# EAGLE design Moteino (EAGLE 6.3)
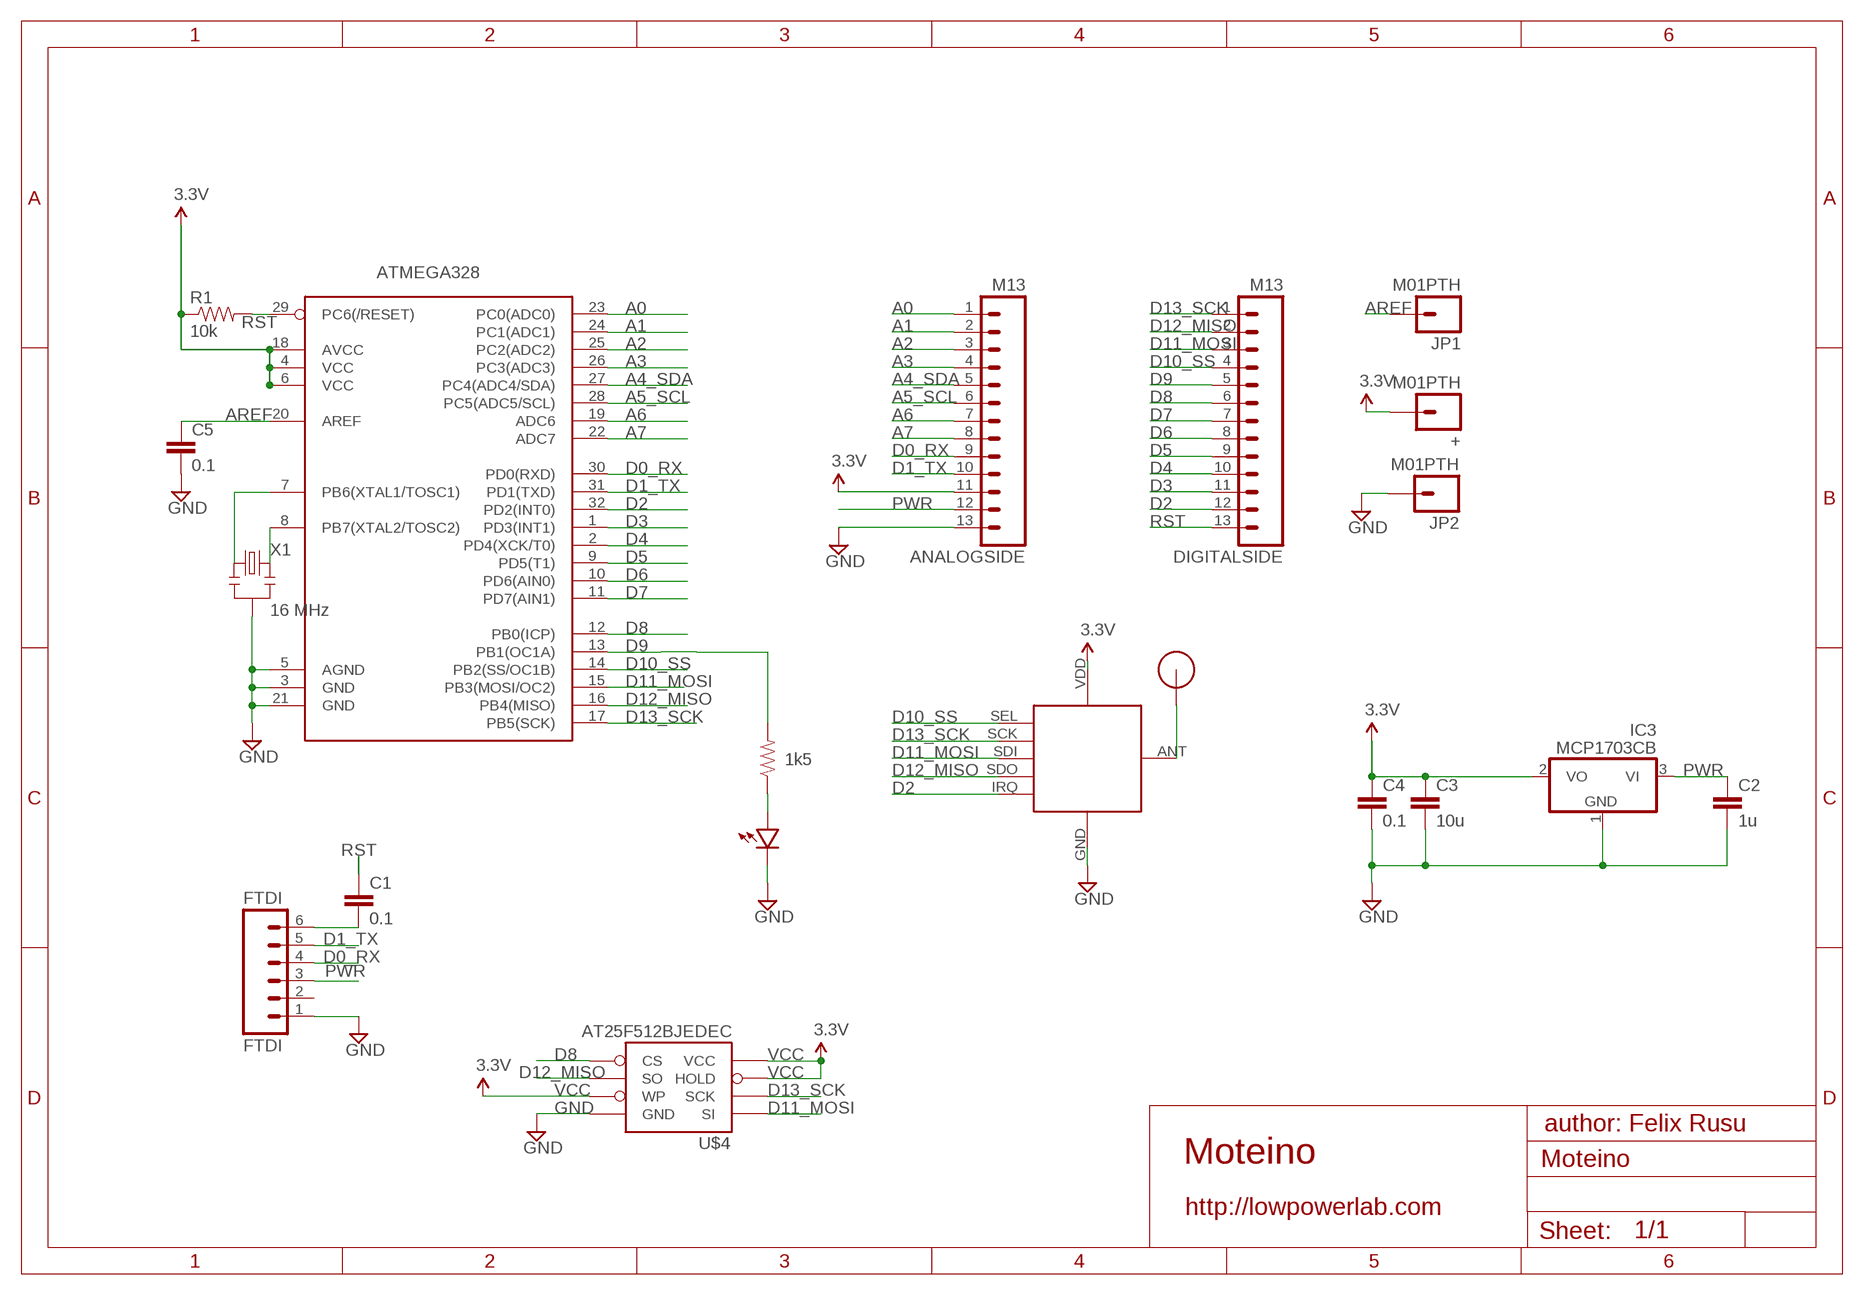
[diagram p0: schematic, sheet 1]

## Parts
+  M01PTH  [1X01]
ANALOGSIDE  M13  [1X13]
ATMEGA328  ATMega-328  ATMEGA168/328TQFP32  [TQFP32-08]
C1  0.1  CAP0603-CAP  [0603-CAP]
C2  1u  CAP0603-CAP  [0603-CAP]
C3  10u  CAP0805-CAP  [0805-CAP]
C4  0.1  CAP0603-CAP  [0603-CAP]
C5  0.1  CAP0603-CAP  [0603-CAP]
DIGITALSIDE  M13  [1X13]
FTDI  FTDI  M06SIP  [1X06]
IC3  MCP1703CB  [SOT23]
JP1  M01PTH  [1X01]
JP2  M01PTH  [1X01]
R1  10k  RESISTOR0603-RES  [0603-RES]
R2  1k5  RESISTOR0603-RES  [0603-RES]
RFM12B  RFM12B_MINPADS  [RFM12B-MINPADS]
U$1  RFM12B_ANTENNA  [RFM12B-ANTENNA]
U$2  LED0603  [0603-LED]
U$4  AT25F512BJEDEC  [SO08]
X1  16 MHz  RESONATORSMD  [RESONATOR-SMD]

## Nets
A0: ANALOGSIDE.1 ATMEGA328.23(PC0(ADC0))
A1: ANALOGSIDE.2 ATMEGA328.24(PC1(ADC1))
A2: ANALOGSIDE.3 ATMEGA328.25(PC2(ADC2))
A3: ANALOGSIDE.4 ATMEGA328.26(PC3(ADC3))
A4_SDA: ANALOGSIDE.5 ATMEGA328.27(PC4(ADC4/SDA))
A5_SCL: ANALOGSIDE.6 ATMEGA328.28(PC5(ADC5/SCL))
A6: ANALOGSIDE.7 ATMEGA328.19(ADC6)
A7: ANALOGSIDE.8 ATMEGA328.22(ADC7)
AREF: ATMEGA328.20(AREF) C5.1 JP1.1
D0_RX: ANALOGSIDE.9 ATMEGA328.30(PD0(RXD)) FTDI.4
D1_TX: ANALOGSIDE.10 ATMEGA328.31(PD1(TXD)) FTDI.5
D2: ATMEGA328.32(PD2(INT0)) DIGITALSIDE.12 RFM12B.IRQ
D3: ATMEGA328.1(PD3(INT1)) DIGITALSIDE.11
D4: ATMEGA328.2(PD4(XCK/T0)) DIGITALSIDE.10
D5: ATMEGA328.9(PD5(T1)) DIGITALSIDE.9
D6: ATMEGA328.10(PD6(AIN0)) DIGITALSIDE.8
D7: ATMEGA328.11(PD7(AIN1)) DIGITALSIDE.7
D8: ATMEGA328.12(PB0(ICP)) DIGITALSIDE.6 U$4.1_CS(CS)
D9: ATMEGA328.13(PB1(OC1A)) DIGITALSIDE.5 R2.2
D10_SS: ATMEGA328.14(PB2(SS/OC1B)) DIGITALSIDE.4 RFM12B.SEL
D11_MOSI: ATMEGA328.15(PB3(MOSI/OC2)) DIGITALSIDE.3 RFM12B.SDI(SDI/MOSI) U$4.5_SI(SI)
D12_MISO: ATMEGA328.16(PB4(MISO)) DIGITALSIDE.2 RFM12B.SDO(SDO/MISO) U$4.2_SO(SO)
D13_SCK: ATMEGA328.17(PB5(SCK)) DIGITALSIDE.1 RFM12B.SCK U$4.6_SCK(SCK)
GND [power]: ANALOGSIDE.13 ATMEGA328.3(GND) ATMEGA328.5(AGND) ATMEGA328.21(GND) C2.2 C3.2 C4.2 C5.2 FTDI.1 IC3.1(GND) JP2.1 RFM12B.GND U$2.MINUS U$4.4_GND(GND) X1.2
N$1: ATMEGA328.7(PB6(XTAL1/TOSC1)) X1.1
N$2: R2.1 U$2.PLUS
N$3: RFM12B.ANT U$1.P$1
N$20: C1.2 FTDI.6
N$21: ATMEGA328.8(PB7(XTAL2/TOSC2)) X1.3
PWR [power]: ANALOGSIDE.12 C2.1 FTDI.3 IC3.3(VI)
RST: ATMEGA328.29(PC6(/RESET)) C1.1 DIGITALSIDE.13 R1.2
VCC: +.1 ANALOGSIDE.11 ATMEGA328.4(VCC) ATMEGA328.6(VCC) ATMEGA328.18(AVCC) C3.1 C4.1 IC3.2(VO) R1.1 RFM12B.VDD U$4.3_WP(WP) U$4.7_HOLD(HOLD) U$4.8_VCC(VCC) ; supply symbol labelled 3.3V
Unconnected: FTDI.2

## Notes on the sheet
- author: Felix Rusu
- Moteino
- http://lowpowerlab.com

## Library data of the parts
+ JP1 JP2 = SparkFun-Connectors:M01: Header 1 Standard 1-pin 0.1" header. Use with straight break away headers (SKU : PRT-00116), right angle break away headers (PRT-00553), swiss pins (PRT-00743), machine pins (PRT-00117), and female headers (PRT-00115).
ANALOGSIDE DIGITALSIDE = SparkFun-Connectors:M13: 13-pin single row .1" header
ATMEGA328 = LowPowerLab:ATMEGA168/328: Atmel 32-pin 8-bit micro, 16k flash.
C1-C5 = LowPowerLab:CAP: Capacitor Standard 0603 ceramic capacitor, and 0.1" leaded capacitor.
FTDI = SparkFun-Connectors:M06: Header 6 Standard 6-pin 0.1" header. Use with straight break away headers (SKU : PRT-00116), right angle break away headers (PRT-00553), swiss pins (PRT-00743), machine pins (PRT-00117), and female headers (PRT-00115). Molex polarized connector foot print use with SKU : PRT-08094 with associated crimp pins and housings. NOTES ON THE VARIANTS LOCK and LOCK_LONGPADS... This footprint was designed to help hold the alignment of a through-hole component (i.e. 6-pin header) while soldering it into place. You may notice that each hole has been shifted either up or down by 0.005 of an inch from it's more standard position (which is a perfectly straight line). This slight alteration caused the pins (the squares in the middle) to touch the edges of the holes. Because they are alternating, it causes a "brace" to hold the component in place. 0.005 has proven to be the perfect amount of "off-center" position when using our standard breakaway headers. Although looks a little odd when you look at the bare footprint, once you have a header in there, the alteration is very hard to notice. Also, if you push a header all the way into place, it is covered up entirely on the bottom side. This idea of altering the position of holes to aid alignment will be further integrated into the Sparkfun Library for other footprints. It can help hold any component with 3 or more connection pins.
IC3 = linear:MCP1703: 250 mA, 16V, Low Quiescent Current LDO Regulator Source: http://ww1.microchip.com/downloads/en/DeviceDoc/22049b.pdf
R1 R2 = LowPowerLab:RESISTOR: Resistor Basic schematic elements and footprints for 0603, 1206, and PTH resistors.
RFM12B = LowPowerLab:RFM12B_MINPADS
U$1 = LowPowerLab:RFM12B_ANTENNA
U$2 = LowPowerLab:LED
U$4 = LowPowerLab:AT25F512B: 4-Mbit SPI flash memory
X1 = SparkFun:RESONATOR: Resonator Small SMD resonator. This is the itty bitty 10/20MHz resonators with built in caps. CSTCE10M0G55 and CSTCE20M0V53. Footprint has been reviewed closely but hasn't been tested yet.

## Net classes
1 power: width 0.381 mm, clearance 0.254 mm

## Board
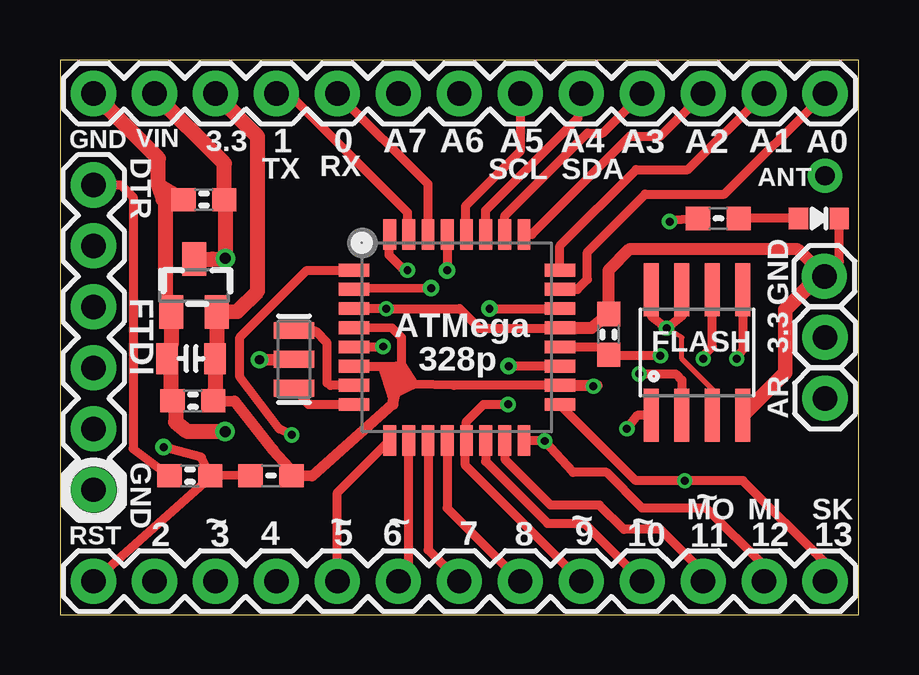
[diagram p1: board, top side]
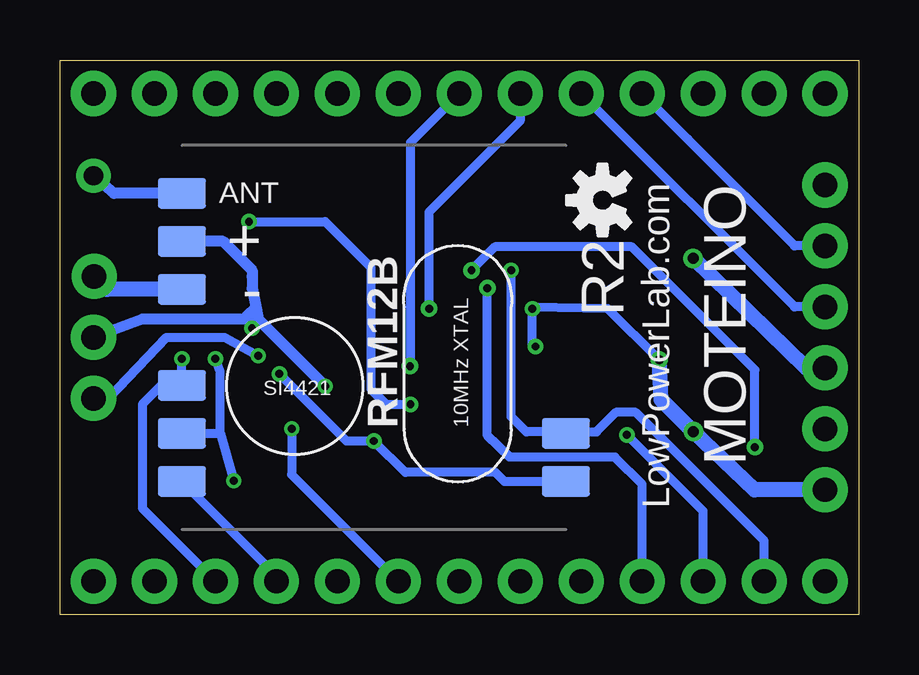
[diagram p2: board, bottom side, seen from below]

Size 33.27 x 23.11 mm. Coordinates in mm from the lower left corner, seen from the top.
Outline: 0,0 33.27,0 33.27,23.11 0,23.11 0,0
Copper layers (1*16): Top 0.035mm / dielectric 1.5mm / Bottom 0.035mm
Design rules "ITEADstudio_DRC": minimum track width 6mil, minimum drill 12mil, track to track 6mil, track to pad 6mil, pad to pad 6mil, via to via 6mil, smd to smd 0mil, copper to edge 10mil, drill to drill 10mil, minimum pad ring 10mil, minimum via ring 6mil, stop-mask expansion 2mil, vias tented up to drill 100mil, thermal gap 10mil

### Footprints (pad centres in the part's own frame; a part is rotated, then mirrored left to right if it is on the bottom)
1X01 = drill 1.016 pad 1.88: 1 0,0
1X13 = drill 1.016 pad 1.88: 1 0,0; 2 2.54,0; 3 5.08,0; 4 7.62,0; 5 10.16,0; 6 12.7,0; 7 15.24,0; 8 17.78,0; 9 20.32,0; 10 22.86,0; 11 25.4,0; 12 27.94,0; 13 30.48,0
TQFP32-08 = smd 1.27 x 0.533: 1 -4.293,2.8; 2 -4.293,2; 3 -4.293,1.2; 4 -4.293,0.4; 5 -4.293,-0.4; 6 -4.293,-1.2; 7 -4.293,-2; 8 -4.293,-2.8; 17 4.293,-2.8; 18 4.293,-2; 19 4.293,-1.2; 20 4.293,-0.4; 21 4.293,0.4; 22 4.293,1.2; 23 4.293,2; 24 4.293,2.8 | smd 0.533 x 1.27: 9 -2.8,-4.293; 10 -2,-4.293; 11 -1.2,-4.293; 12 -0.4,-4.293; 13 0.4,-4.293; 14 1.2,-4.293; 15 2,-4.293; 16 2.8,-4.293; 25 2.8,4.293; 26 2,4.293; 27 1.2,4.293; 28 0.4,4.293; 29 -0.4,4.293; 30 -1.2,4.293; 31 -2,4.293; 32 -2.8,4.293
0603-CAP = smd 1.016 x 0.965: 1 -0.85,0; 2 0.85,0
0805-CAP = smd 0.902 x 1.3: 1 -1,0; 2 1,0
1X06 = drill 1.016 pad 1.88: 1 0,0; 2 2.54,0; 3 5.08,0; 4 7.62,0; 5 10.16,0; 6 12.7,0
SOT23 = smd 1 x 1.4: 1 -0.95,-1.1; 2 0.95,-1.1; 3 0,1.1
0603-RES = smd 1.016 x 0.965: 1 -0.85,0; 2 0.85,0
RFM12B-MINPADS = smd 2 x 1.27: ANT 8,-6; GND 8,-2; IRQ -8,4; SCK 8,4; SDI 8,2; SDO -8,6; SEL 8,6; VDD 8,-4
RFM12B-ANTENNA = drill 0.8 pad 1.422: P$1 0,0
0603-LED = smd 0.8 x 0.9: MINUS -0.85,0; PLUS 0.85,0
SO08 = smd 0.61 x 2.21: 1_CS -1.905,-2.616; 2_SO -0.635,-2.616; 3_WP 0.635,-2.616; 4_GND 1.905,-2.616; 5_SI 1.905,2.616; 6_SCK 0.635,2.616; 7_HOLD -0.635,2.616; 8_VCC -1.905,2.616
RESONATOR-SMD = smd 0.7 x 1.7: 1 -1.2,0; 2 0,0; 3 1.2,0

### Placement (x,y rotation side)
+  31.88,11.56 270 top
ANALOGSIDE  31.88,21.72 180 top
ATMEGA328  16.54,11.56 0 top
C1  5.41,5.79 180 top
C2  5.99,17.3 180 top
C3  5.46,10.67 180 top
C4  5.54,8.92 180 top
C5  22.86,11.68 90 top
DIGITALSIDE  31.88,1.4 180 top
FTDI  1.4,5.21 90 top
IC3  5.59,13.72 0 top
JP1  31.88,9.02 0 top
JP2  31.85,14.1 0 top
R1  8.79,5.79 180 top
R2  27.43,16.51 180 top
RFM12B  20.19,11.56 180 bottom
U$1  31.88,18.29 0 top
U$2  31.62,16.51 180 top
U$3  [OSHW-LOGO-S]  10.67,17.27 90 bottom
U$4  26.54,10.92 0 top
X1  9.75,10.64 270 top

### Tracks (layer width: path | path; a pad name or v marks a point on that pad's centre or on a via)
A0
  Top 0.381: ATMEGA328.23 21.56,13.56 21.97,13.97 21.97,15.11 24.38,17.53 27.69,17.53 ANALOGSIDE.1
A1
  Top 0.381: ATMEGA328.24 20.83,15.37 24,18.54 26.16,18.54 ANALOGSIDE.2
A2
  Top 0.381: ATMEGA328.25 19.66,15.85 23.75,19.94 25.02,19.94 ANALOGSIDE.3
A3
  Top 0.381: ATMEGA328.26 18.54,16.63 21.97,20.07 22.61,20.07 ANALOGSIDE.4
A4_SDA
  Top 0.381: ATMEGA328.27 17.73,16.85 21.59,20.7 21.59,21.59 ANALOGSIDE.5
A5_SCL
  Top 0.381: ANALOGSIDE.6 19.18,19.3 16.89,17.02 16.89,15.89 ATMEGA328.28
A6  (via drill 0.33 pad 0.69)
  Top 0.381: ATMEGA328.19 v18.69,10.36
  Bottom 0.381: v18.69,10.36 18.67,10.41 18.67,19.68 ANALOGSIDE.7
A7  (via drill 0.33 pad 0.69)
  Top 0.381: v17.9,12.76 ATMEGA328.22
  Bottom 0.254: 17.9,12.84 v17.9,12.76
  Bottom 0.381: ANALOGSIDE.8 14.1,20.57 17.91,16.76 v17.91,12.77 v17.9,12.76
AREF  (via drill 0.33)
  Top 0.381: ATMEGA328.20 22.54,11.16 C5.1 22.9,10.79 v25.02,10.79
  Bottom 0.381: JP1.1 31.24,9.02 28.83,11.56 26.42,11.56 v25.02,10.79
D0_RX
  Top 0.381: ATMEGA328.30 15.34,17.94 ANALOGSIDE.9
  Bottom 0.381: FTDI.4 2.67,12.83 ANALOGSIDE.9
D1_TX
  Top 0.381: ANALOGSIDE.10 9.53,21.72 14.48,16.76 14.48,15.91 ATMEGA328.31
  Bottom 0.381: FTDI.5 2.67,15.37 6.86,19.56 7.11,19.81 ANALOGSIDE.10
D2  (via drill 0.33)
  Top 0.381: v14.48,14.35 14.22,14.48 13.72,14.99 13.72,15.83 ATMEGA328.32
  Bottom 0.381: DIGITALSIDE.12 3.94,3.07 9.29,8.43 10.12,8.43 10.92,7.62 11.56,7.62 | v14.48,14.35 14.48,8.26 14,7.77 13.84,7.62 11.77,7.62 11.56,7.62 | RFM12B.IRQ 11.62,7.56 11.56,7.62
D3  (via drill 0.33)
  Top 0.381: v9.65,7.49 9.14,7.75 7.49,9.91 7.49,11.56 10.29,14.35 ATMEGA328.1
  Bottom 0.381: DIGITALSIDE.11 6.48,4.24 6.48,4.32 v9.65,7.49
D4  (via drill 0.33 pad 0.69)
  Top 0.356: v15.46,13.61 12.29,13.61
  Top 0.381: 12.29,13.61 ATMEGA328.2
  Bottom 0.381: v15.46,13.61 15.46,7.46 14.54,6.57 10.15,6.57 9.02,5.43 DIGITALSIDE.10
D5
  Top 0.381: DIGITALSIDE.9 11.56,5.09 ATMEGA328.9
D6
  Top 0.381: DIGITALSIDE.8 14.54,1.83 ATMEGA328.10
D7
  Top 0.381: ATMEGA328.11 15.34,2.7 DIGITALSIDE.7
D8  (via drill 0.33)
  Top 0.381: ATMEGA328.12 16.14,4.44 DIGITALSIDE.6 | U$4.1_CS 24.05,8.31 v23.62,7.75
  Bottom 0.381: v23.62,7.75 23.62,5.84 DIGITALSIDE.6
D9  (via drill 0.33)
  Top 0.381: R2.2 25.44,16.42 v25.4,16.38 | DIGITALSIDE.5 16.89,6.22 16.89,7.31 ATMEGA328.13 16.93,8.04 17.65,8.76 v18.67,8.76
  Bottom 0.381: v25.4,16.38 22.23,16.38 20.32,14.48 20.32,9.4 19.68,8.76 19.56,8.76 v18.67,8.76
D10_SS
  Top 0.381: ATMEGA328.14 17.73,6.39 20.32,3.81 21.84,3.81 DIGITALSIDE.4
  Bottom 0.381: DIGITALSIDE.4 24.26,1.62 RFM12B.SEL
D11_MOSI  (via drill 0.33)
  Top 0.381: ATMEGA328.15 18.54,6.48 20.45,4.57 22.48,4.57 23.5,3.56 25.02,3.56 26.8,1.78 DIGITALSIDE.3 | U$4.5_SI 28.45,11.05 v28.19,10.67
  Bottom 0.381: DIGITALSIDE.3 29.84,4.45 29.84,8.76 29.05,9.56 RFM12B.SDI 28.19,10.79 v28.19,10.67
D12_MISO  (via drill 0.33)
  Top 0.381: v24.13,10.03 25.65,10.03 25.91,9.78 U$4.2_SO | ATMEGA328.16 20.04,7.26 v20.19,7.24 21.38,5.93 22.77,5.93 24.26,4.45 26.92,4.45 29.34,2.03 DIGITALSIDE.2
  Bottom 0.381: RFM12B.SDO 14.76,5.56 15.13,5.93 18.88,5.93 v20.19,7.24 21.34,7.24 v24.13,10.03
D13_SCK  (via drill 0.33)
  Top 0.381: v26.8,10.67 26.8,10.79 27.18,11.18 U$4.6_SCK | ATMEGA328.17 24,5.59 v26.04,5.59 28.45,5.59 31.88,2.16 DIGITALSIDE.1
  Bottom 0.381: RFM12B.SCK 26.61,7.56 | 26.61,7.56 v26.04,5.59 | 26.61,7.56 26.61,10.1 v26.8,10.67
GND  (via drill 0.33, 0.38 pad 0.71, 0.46 pad 0.81)
  Top 0.381: 4.64,12.04 IC3.1 | C4.2 4.82,9.07 | ATMEGA328.21 20.81,11.94 17.4,11.94 17.4,12.01 16.66,12.75 v13.59,12.75 ATMEGA328.3 | 9.02,10.64 X1.2 | ATMEGA328.5 13.44,11.16 v13.46,11.18 | U$2.MINUS 32.47,14.72 31.88,14.12 JP2.1 31.62,14.1
  Top 0.508: v8.31,10.62 9.02,10.64 | IC3.1 4.62,12.98 | 4.64,11.29 4.61,10.53 | 5.05,17.32 C2.2 | ATMEGA328.21 22.16,11.96 C5.2 22.86,14.35 23.75,15.24 30.71,15.24 JP2.1
  Top 0.61: U$4.4_GND 30.23,10.08 30.23,12.7 31.62,14.1
  Top 0.635: 4.64,12.04 4.64,11.29 | v6.88,7.62 5.31,7.62 4.82,8.02 4.82,9.07 | 4.09,17.89 4.29,17.3 5.03,17.27 4.39,17.04 4.39,13.18 IC3.1 | 4.09,17.89 5.05,17.32 | C4.2 4.61,9.12 4.61,10.53 4.6,10.66 C3.2 | 4.09,17.89 4.09,19.02 ANALOGSIDE.13
  Bottom 0.381: v8.31,10.62 10.45,12.76 13.59,12.81 v13.59,12.75 13.59,11.18 v13.46,11.18
  Bottom 0.635: v8.31,10.62 8.22,8.97 v6.88,7.62 4.34,5.21 FTDI.1 | 31.31,13.56 JP2.1 31.31,13.56 | RFM12B.GND 31.31,13.56
N$1
  Top 0.381: ATMEGA328.7 11.27,9.56 11.12,9.65 11.12,11.33 10.67,11.81 9.71,11.81 X1.1
N$2
  Top 0.381: U$2.PLUS R2.1
N$3
  Bottom 0.457: RFM12B.ANT 31.02,17.56 U$1.P$1
N$20
  Top 0.381: FTDI.6 2.54,17.91 3.05,17.4 3.05,6.92 C1.2
N$21
  Top 0.381: ATMEGA328.8 10.36,8.76 X1.3
PWR  (via drill 0.46 pad 0.81)
  Top 0.635: IC3.3 6.35,14.82 v6.89,14.85 6.89,17.3 C2.1 6.84,18.81 6.78,18.87 ANALOGSIDE.12
  Bottom 0.635: FTDI.3 2.2,10.29 v6.89,14.85
RST  (via drill 0.33 pad 0.69)
  Top 0.254: 6.55,6.04 6.46,5.8
  Top 0.381: R1.2 6.46,5.8 | C1.1 6.55,6.04 | C1.1 6.01,5.5 DIGITALSIDE.13 | C1.1 5.89,6.55 v4.32,6.99 | ATMEGA328.29 v16.14,14.36 v16.13,14.35
  Bottom 0.381: v16.13,14.35 15.15,15.33 9.45,15.33 4.36,10.24 4.32,10.2 v4.32,6.99 | DIGITALSIDE.13
VCC  (via drill 0.33)
  Top 0.203: U$4.3_WP 27.18,9.4 25.91,10.67 25.91,11.56 v25.27,11.94
  Top 0.356: ATMEGA328.4 13.82,11.96
  Top 0.381: C4.1 6.48,9.5 | 13.82,11.96 14.22,11.56 14.22,10.41 | 14.22,10.41 14.48,9.53 | ATMEGA328.6 14.03,10.36 14.22,10.41 | ATMEGA328.18 16.41,9.56 14.73,9.61 14.68,9.62 | U$4.8_VCC 24.64,12.45 v25.27,11.94 25.91,12.45 U$4.7_HOLD
  Top 0.406: 14.48,9.53 13.46,10.29 13.84,9.14 14.22,10.41 14.73,9.61
  Top 0.457: R1.1 10.51,5.78 13.87,8.77 13.96,9.28 14.68,9.62 | 9.78,5.88 8.89,6.86 7.27,8.9 C4.1 | ATMEGA328.18 22.38,9.56 v22.23,9.53
  Top 0.508: 6.54,10.85 6.54,11.05
  Top 0.635: 6.54,11.05 IC3.2 7.39,12.64 8.23,13.48 8.23,19.93 ANALOGSIDE.11 | R1.1 9.78,5.88 | C4.1 6.46,9.37 C3.1 6.46,10.8 6.54,10.85
  Bottom 0.381: 25.27,13.59 25.27,14.1 | v25.27,11.94 25.53,12.46 25.13,12.86
  Bottom 0.457: v22.23,9.53 25.02,12.32 | 25.02,12.32 29.84,12.32 +.1 | 25.02,12.32 25.13,12.86 25.27,13.59 25.27,14.1 25.27,14.35 26.48,15.56 RFM12B.VDD

### Text on the board
bPlace: RFM12B | R2 | MOTEINO | LowPowerLab.com
tDocu: REG
_tsilk: VIN | 3.3 | 1 | 0 | A7 | A6 | A5 | A4 | A3 | A2 | A1 | GND | DTR | TX | RX | A0 | SCL | SDA | ANT | GND | 3.3 | ATMega | FLASH | FTDI | 328p | AR | GND | 2 | 3 | 4 | 5 | 6 | 7 | 8 | 9 | 10 | MO | ~ | 11 | MI | 12 | SK | 13 | RST | ~ | ~ | ~ | ~ | ~
_bsilk: VIN | 3.3 | 1 | 0 | A7 | A6 | A5 | A4 | A3 | A2 | A1 | A0 | GND | ANT | DTR | GND | 3.3 | + | AREF | GND | 2 | 3 | 4 | 5 | 6 | 7 | 8 | 9 | 10 | 11 | 12 | 13 | RST